# EAGLE schematic Customised arduino (EAGLE 9.6.2)
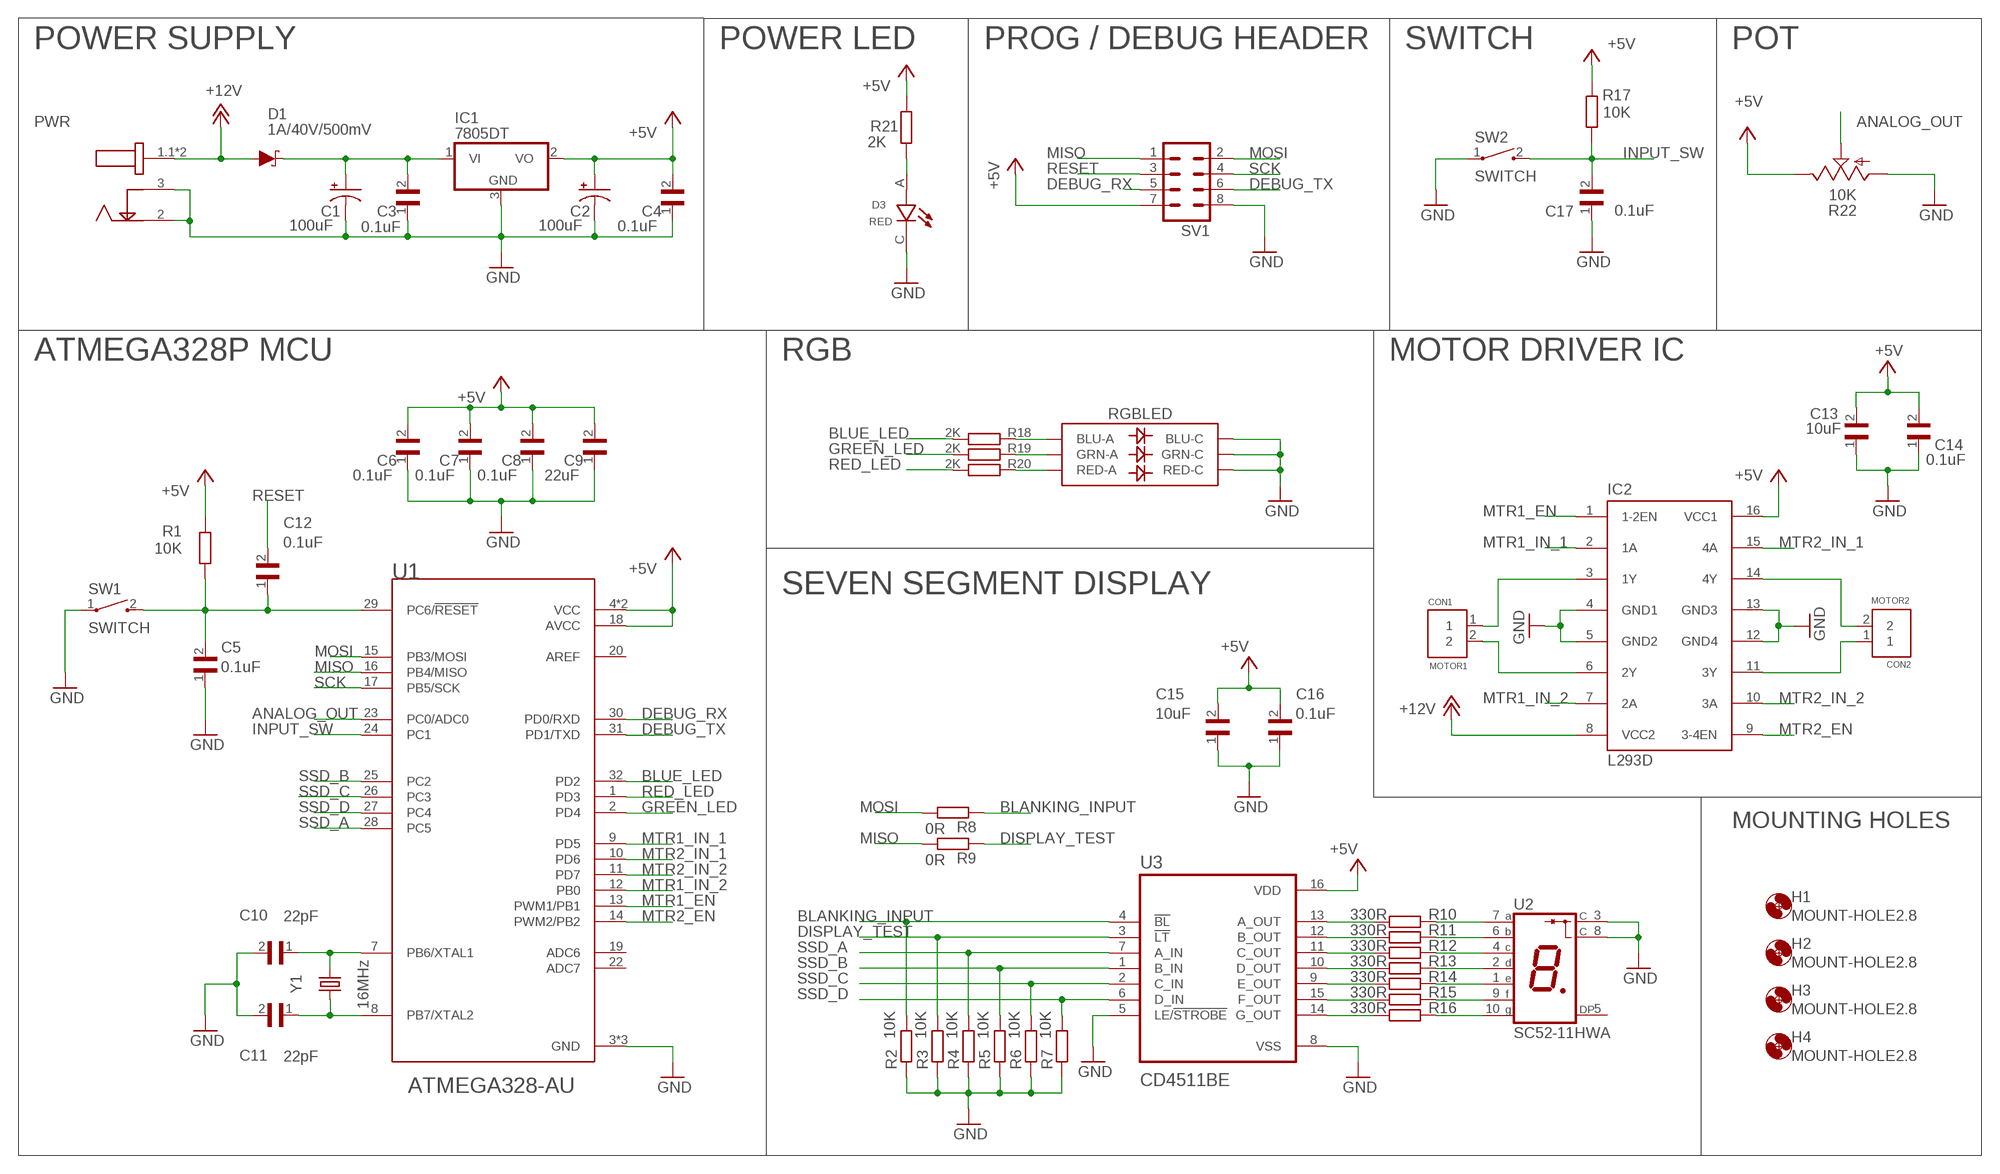
[diagram p0: schematic, sheet 1]

## Parts
C1  100uF  100UF-POLAR-RADIAL-2.5MM-25V-20%  [CPOL-RADIAL-2.5MM-6.5MM]
C2  100uF  100UF-POLAR-RADIAL-2.5MM-25V-20%  [CPOL-RADIAL-2.5MM-6.5MM]
C3  0.1uF  CAPACITOR  [C0603]
C4  0.1uF  CAPACITOR  [C0603]
C5  0.1uF  CAPACITOR  [C0603]
C6  0.1uF  CAPACITOR  [C0603]
C7  0.1uF  CAPACITOR  [C0603]
C8  0.1uF  CAPACITOR  [C0603]
C9  22uF  CAPACITOR  [C0603]
C10  22pF  CAPACITOR  [C0603]
C11  22pF  CAPACITOR  [C0603]
C12  0.1uF  CAPACITOR  [C0603]
C13  10uF  CAPACITOR  [C0603]
C14  0.1uF  CAPACITOR  [C0603]
C15  10uF  CAPACITOR  [C0603]
C16  0.1uF  CAPACITOR  [C0603]
C17  0.1uF  CAPACITOR  [C0603]
CON1  MOTOR1  282836-2  [CONN_282836-2]
CON2  MOTOR2  282836-2  [CONN_282836-2]
D1  1A/40V/500mV  DIODE-SCHOTTKY-SS14  [SMA-DIODE]
D3  RED  LTW-C191TLA  [LEDC1608X65N]
H1  MOUNT-HOLE2.8  [2,8]
H2  MOUNT-HOLE2.8  [2,8]
H3  MOUNT-HOLE2.8  [2,8]
H4  MOUNT-HOLE2.8  [2,8]
IC1  7805DT  [TO252]
IC2  L293D  [DIL16]
PWR  DCJ200-05-A-XX-X_REVA  [GCT_DCJ200-05-A-XX-X_REVA]
R1  10K  RESISTOR  [R0603]
R2  10K  RESISTOR  [R0603]
R3  10K  RESISTOR  [R0603]
R4  10K  RESISTOR  [R0603]
R5  10K  RESISTOR  [R0603]
R6  10K  RESISTOR  [R0603]
R7  10K  RESISTOR  [R0603]
R8  0R  RESISTOR  [R0603]
R9  0R  RESISTOR  [R0603]
R10  330R  RESISTOR  [R0603]
R11  330R  RESISTOR  [R0603]
R12  330R  RESISTOR  [R0603]
R13  330R  RESISTOR  [R0603]
R14  330R  RESISTOR  [R0603]
R15  330R  RESISTOR  [R0603]
R16  330R  RESISTOR  [R0603]
R17  10K  RESISTOR  [R0603]
R18  2K  RESISTOR  [R0603]
R19  2K  RESISTOR  [R0603]
R20  2K  RESISTOR  [R0603]
R21  2K  RESISTOR  [R0603]
R22  10K  TRIM_US-S64W  [S64W]
RGBLED  LED-RGBNO_IC  [LED-TRICOLOR-5050]
SV1  MA04-2  [MA04-2]
SW1  SWITCH  1437566-3  [SW_1437566-3]
SW2  SWITCH  1437566-3  [SW_1437566-3]
U1  ATMEGA328-AU  [QFP80P900X900X120-32N]
U2  SC52-11HWA  [LED_SC52-11HWA]
U3  CD4511BE  [DIP794W45P254L1969H508Q16]
Y1  16MHz  CRYSTAL-16MHZPTH-HC49US  [HC49US]

## Nets
+5V: C2.1(+) C4.2 C6.2 C7.2 C8.2 C9.2 C13.2 C14.2 C15.2 C16.2 IC1.2(VO) IC2.16(VCC1) R1.2 R17.2 R21.2 R22.E SV1.7 U1.4(VCC) U1.6(VCC) U1.18(AVCC) U3.16(VDD)
+12V: D1.A IC2.8(VCC2) PWR.1.1 PWR.1.2
ANALOG_OUT: R22.S U1.23(PC0/ADC0)
BLANKING_INPUT: R2.2 R8.1 U3.4(!BL)
BLUE_LED: R18.2 U1.32(PD2)
DEBUG_RX: SV1.5 U1.30(PD0/RXD)
DEBUG_TX: SV1.6 U1.31(PD1/TXD)
DISPLAY_TEST: R3.2 R9.1 U3.3(!LT)
GND: C1.2(-) C2.2(-) C3.1 C4.1 C5.1 C6.1 C7.1 C8.1 C9.1 C10.2 C11.2 C13.1 C14.1 C15.1 C16.1 C17.1 D3.C IC1.3(GND) IC2.4(GND1) IC2.5(GND2) IC2.12(GND4) IC2.13(GND3) PWR.2 PWR.3 R2.1 R3.1 R4.1 R5.1 R6.1 R7.1 R22.A RGBLED.4(BLU-C) RGBLED.5(RED-C) RGBLED.6(GRN-C) SV1.8 SW1.1 SW2.1 U1.3(GND) U1.5(GND) U1.21(GND) U2.3(C) U2.8(C) U3.5(LE/!STROBE) U3.8(VSS)
GREEN_LED: R19.2 U1.2(PD4)
INPUT_SW: C17.2 R17.1 SW2.2 U1.24(PC1)
MISO: R9.2 SV1.1 U1.16(PB4/MISO)
MOSI: R8.2 SV1.2 U1.15(PB3/MOSI)
MTR1_EN: IC2.1(1-2EN) U1.13(PWM1/PB1)
MTR1_IN_1: IC2.2(1A) U1.9(PD5)
MTR1_IN_2: IC2.7(2A) U1.12(PB0)
MTR2_EN: IC2.9(3-4EN) U1.14(PWM2/PB2)
MTR2_IN_1: IC2.15(4A) U1.10(PD6)
MTR2_IN_2: IC2.10(3A) U1.11(PD7)
N$1: C10.1 U1.7(PB6/XTAL1) Y1.2
N$2: C1.1(+) C3.2 D1.C IC1.1(VI)
N$3: C5.2 C12.1 R1.1 SW1.2 U1.29(PC6/!RESET)
N$4: C11.1 U1.8(PB7/XTAL2) Y1.1
N$5: CON1.1 IC2.3(1Y)
N$6: CON1.2 IC2.6(2Y)
N$7: CON2.2 IC2.14(4Y)
N$8: CON2.1 IC2.11(3Y)
N$9: R10.2 U3.13(A_OUT)
N$10: R11.2 U3.12(B_OUT)
N$11: R12.2 U3.11(C_OUT)
N$12: R13.2 U3.10(D_OUT)
N$13: R14.2 U3.9(E_OUT)
N$14: R15.2 U3.15(F_OUT)
N$15: R16.2 U3.14(G_OUT)
N$16: R10.1 U2.7(A)
N$17: R11.1 U2.6(B)
N$18: R12.1 U2.4(C)
N$19: R13.1 U2.2(D)
N$20: R14.1 U2.1(E)
N$21: R15.1 U2.9(F)
N$22: R16.1 U2.10(G)
N$23: R18.1 RGBLED.3(BLU-A)
N$24: R19.1 RGBLED.1(GRN-A)
N$25: R20.1 RGBLED.2(RED-A)
N$26: D3.A R21.1
RED_LED: R20.2 U1.1(PD3)
RESET: C12.2 SV1.3
SCK: SV1.4 U1.17(PB5/SCK)
SSD_A: R4.2 U1.28(PC5) U3.7(A_IN)
SSD_B: R5.2 U1.25(PC2) U3.1(B_IN)
SSD_C: R6.2 U1.26(PC3) U3.2(C_IN)
SSD_D: R7.2 U1.27(PC4) U3.6(D_IN)
Unconnected: U1.19(ADC6) U1.20(AREF) U1.22(ADC7) U2.5(DP)

## Notes on the sheet
- POWER SUPPLY | POWER LED | PROG / DEBUG HEADER | SWITCH | POT
- ATMEGA328P MCU | RGB | MOTOR DRIVER IC
- SEVEN SEGMENT DISPLAY
- MOUNTING HOLES

## Library data of the parts
C1 C2 = SparkFun-Capacitors:100UF-POLAR: 100µF polarized capacitors A capacitor is a passive two-terminal electrical component used to store electrical energy temporarily in an electric field.; PROD_ID: CAP-08439
C3-C17 = PC_Capacitor_0603:CAPACITOR: CAP CERAMIC, 0.1UF, 50V, X7R, 0603, FULL REEL Check prices <https://pricing.snapeda.com/parts/CGA3E2X7R1H104K080AA/TDK/view-part?ref=eda>; AVAILABILITY: Good; DESCRIPTION: 0.1µF ±10% 50V Ceramic Capacitor X7R 0603 (1608 Metric); MF: TDK; MP: CGA3E2X7R1H104K080AA; PACKAGE: 1608 TDK; PRICE: None; PURCHASE-URL: https://pricing.snapeda.com/search/part/CGA3E2X7R1H104K080AA/?ref=eda
CON1 CON2 = PC_Con_ScrewTerminal_2P_5mm:282836-2: TERM BLOCK 2POS SIDE ENTRY 5MM Check availability <https://pricing.snapeda.com/parts/282836-2/TE%20Connectivity/view-part?ref=eda>; AVAILABILITY: In Stock; COMMENT: 282836-2; DESCRIPTION: Connector, Terminal Block; Wire Receptacle; 2 Pos.; 16-30 AWG; 0.197 in. CL; Sid; MF: TE Connectivity; MP: 282836-2; PACKAGE: None; PRICE: None; PURCHASE-URL: https://pricing.snapeda.com/search/part/282836-2/?ref=eda
D1 = SparkFun-DiscreteSemi:DIODE-SCHOTTKY: Schottky diode A Schottky diode is a semiconductor diode which has a low forward voltage drop and a very fast switching action.; PROD_ID: DIO-08053
D3 = PC_LED_0603:LTW-C191TLA: CHIP LED WHITE 0603 TOP VIEW Check prices <https://pricing.snapeda.com/parts/LTW-C191TLA/Lite-On/view-part?ref=eda>; AVAILABILITY: Warning; DESCRIPTION: White LED Indication - Discrete 3.1V 0603 (1608 Metric); MF: Lite-On; MP: LTW-C191TLA; PACKAGE: 0603 Lite-On; PRICE: None; PURCHASE-URL: https://pricing.snapeda.com/search/part/LTW-C191TLA/?ref=eda
H1-H4 = holes:MOUNT-HOLE: MOUNTING HOLE with drill center marker
IC1 = linear:78*: Positive VOLTAGE REGULATOR Source: http://cache.national.com/ds/LM/LM78L05.pdf http://www.fairchildsemi.com/ds/LM/LM7805.pdf
IC2 = st-microelectronics:L293D: PUSH-PULL 4 CHANNEL DRIVER; MPN: L293D; OC_FARNELL: 9589619; OC_NEWARK: 56P8249
PWR = PC_CON_DC_Power_Jack:DCJ200-05-A-XX-X_REVA: DC Power Jack, SMT, Horizontal, with Locating Pegs, D2.0mm Check prices <https://pricing.snapeda.com/parts/DCJ200-05-A-K1-A/Global%20Connector%20Technology/view-part?ref=eda>; AVAILABILITY: Warning; DESCRIPTION: Power Barrel Connector Jack 2.05mm ID (0.081), 5.50mm OD (0.217) Surface Mount, Right Angle; MF: Global Connector Technology; MP: DCJ200-05-A-K1-A; PACKAGE: None; PRICE: None; PURCHASE-URL: https://pricing.snapeda.com/search/part/DCJ200-05-A-K1-A/?ref=eda
R1-R21 = PC_Resistor_0603:RESISTOR; MF: Yageo; RESISTOR: 0603
R22 = pot:TRIM_US-: POTENTIOMETER
RGBLED = SparkFun-LED:LED-RGB: LED-RGB 6 pin RGB LED (no common connector) Packages: PLCC-6 LED-TRICOLOR-5050 - No built-in IC SparkFun Products: Digital Sandbox <https://www.sparkfun.com/products/12651> LED- SMD RGB <https://www.sparkfun.com/products/10866>; PROD_ID: DIO-10298
SV1 = con-lstb:MA04-2: PIN HEADER; OC_FARNELL: unknown; OC_NEWARK: unknown
SW1 SW2 = PC_Switch_1437566-3:1437566-3: Switch Tactile OFF (ON) SPST Rectangular Button Gull Wing 0.05A 12VDC SMD Loose Piece Check prices <https://pricing.snapeda.com/parts/1437566-3/TE%20Connectivity/view-part?ref=eda>; AVAILABILITY: Good; COMMENT: 1437566-3; CONFIGURATION_POLE-THROW: Single Pole - Single Throw; CONTACT_CURRENT_RATING: 50 mA; DESCRIPTION: Tactile Switch SPST-NO Top Actuated Surface Mount; MF: TE Connectivity; MP: 1437566-3; PACKAGE: None; PRICE: None
U1 = PC_IC_ATMEGA328-AU:ATMEGA328-AU: ATmega Series 20 MHz 32 KB Flash 2 KB SRAM 8-Bit Microcontroller - TQFP-32 Check prices <https://pricing.snapeda.com/parts/ATMEGA328-AU/Microchip/view-part?ref=eda>; AVAILABILITY: In Stock; DESCRIPTION: AVR AVR® ATmega Microcontroller IC 8-Bit 20MHz 32KB (16K x 16) FLASH 32-TQFP (7x7); MF: Microchip; MP: ATMEGA328-AU; PACKAGE: TQFP-32 Microchip; PRICE: None; PURCHASE-URL: https://pricing.snapeda.com/search/part/ATMEGA328-AU/?ref=eda
U2 = PC_LED-7-SegmentDisplay:SC52-11HWA: Display: LED; single 7-segment; 13.2mm; red; 0.9-2.2mcd Check availability <https://pricing.snapeda.com/parts/SC52-11HWA/Kingbright/view-part?ref=eda>; AVAILABILITY: Not in stock; DESCRIPTION: Display: LED; single 7-segment; 13.2mm; red; 0.9-2.2mcd; MF: Kingbright; MP: SC52-11HWA; PACKAGE: None; PRICE: None
U3 = PC_IC_CD4511BE:CD4511BE: None Check availability <https://pricing.snapeda.com/parts/CD4511BE/Texas%20Instruments/view-part?ref=eda>; AVAILABILITY: In Stock; DESCRIPTION: CMOS BCD-to-7-Segment LED Latch Decoder Drivers 16-PDIP -55 to 125; MF: Texas Instruments; MP: CD4511BE; PACKAGE: PDIP-16 Texas Instruments; PRICE: None; PURCHASE-URL: https://pricing.snapeda.com/search/part/CD4511BE/?ref=eda
Y1 = SparkFun-Clocks:CRYSTAL-16MHZ: 16MHz Crystal Digikey Example <http://www.digikey.com/product-search/en?keywords=535-9122-1-ND> Frequency: 16MHz Frequency Stability: ±50ppm Frequency Tolerance: ±20ppm Load Capacitance: 18pF SparkFun Products: Pro Micro -5V/16MHz <https://www.sparkfun.com/products/12640> SparkFun Serial Enabled LCD Kit <https://www.sparkfun.com/products/10097>; PROD_ID: XTAL-08181; SF_ID: COM-00536